# Altium project van_logic_board.PrjPcb
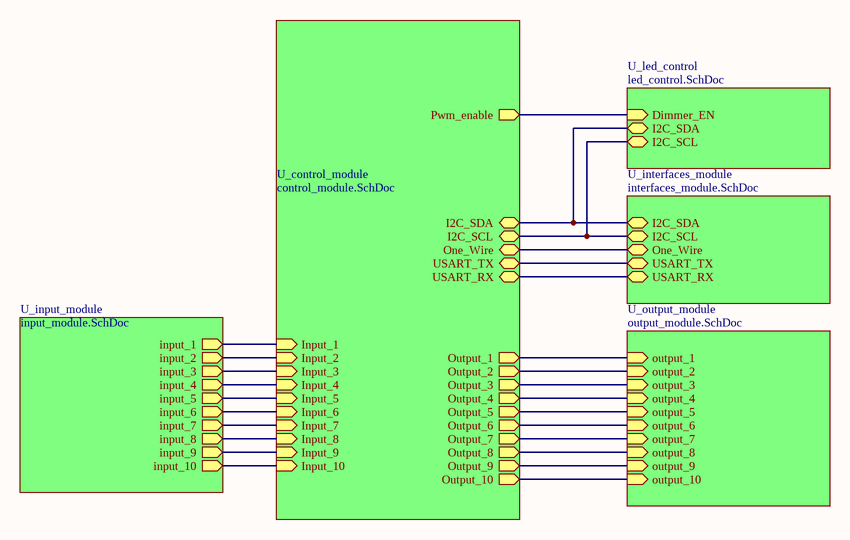
[diagram p0: main.SchDoc]
4 sheets, 61 parts. Net scope: hierarchical (ports join the sheet entries above them; power ports are global).
Board file: logic_board.PcbDoc
Sheets:
  main.SchDoc
  inputs.SchDoc
  mcu_power_supply.SchDoc
  pwm_outputs.SchDoc

## Sheet main.SchDoc
size A4

### Sub-sheets
U_control_module = control_module.SchDoc (file not in this document): I2C_SDA (bidir), USART_RX (bidir), USART_TX (bidir), I2C_SCL (bidir), One_Wire (bidir), Input_4 (in), Input_5 (in), Input_1 (in), Input_2 (in), Input_6 (in), Input_3 (in), Output_6 (out), Output_2 (out), Output_4 (out), Output_5 (out), Output_1 (out), Output_3 (out), Input_8 (in), Input_9 (in), Input_7 (in), Input_10 (in), Output_9 (out), Output_10 (out), Output_8 (out), Output_7 (out), Pwm_enable (out)
U_input_module = input_module.SchDoc (file not in this document): input_1 (out), input_2 (out), input_3 (out), input_4 (out), input_5 (out), input_6 (out), input_9 (out), input_10 (out), input_7 (out), input_8 (out)
U_interfaces_module = interfaces_module.SchDoc (file not in this document): I2C_SDA (bidir), I2C_SCL (bidir), One_Wire (bidir), USART_TX (bidir), USART_RX (bidir)
U_led_control = led_control.SchDoc (file not in this document): I2C_SDA (bidir), I2C_SCL (bidir), Dimmer_EN (in)
U_output_module = output_module.SchDoc (file not in this document): output_3 (in), output_4 (in), output_2 (in), output_5 (in), output_1 (in), output_6 (in), output_7 (in), output_8 (in), output_9 (in), output_10 (in)

### Nets
(unnamed): sheet U_control_module/I2C_SDA, sheet U_interfaces_module/I2C_SDA, sheet U_led_control/I2C_SDA
(unnamed): sheet U_control_module/USART_RX, sheet U_interfaces_module/USART_RX
(unnamed): sheet U_control_module/USART_TX, sheet U_interfaces_module/USART_TX
(unnamed): sheet U_control_module/I2C_SCL, sheet U_interfaces_module/I2C_SCL, sheet U_led_control/I2C_SCL
(unnamed): sheet U_control_module/One_Wire, sheet U_interfaces_module/One_Wire
(unnamed): sheet U_control_module/Input_4, sheet U_input_module/input_4
(unnamed): sheet U_control_module/Input_5, sheet U_input_module/input_5
(unnamed): sheet U_control_module/Input_1, sheet U_input_module/input_1
(unnamed): sheet U_control_module/Input_2, sheet U_input_module/input_2
(unnamed): sheet U_control_module/Input_6, sheet U_input_module/input_6
(unnamed): sheet U_control_module/Input_3, sheet U_input_module/input_3
(unnamed): sheet U_control_module/Output_6, sheet U_output_module/output_6
(unnamed): sheet U_control_module/Output_2, sheet U_output_module/output_2
(unnamed): sheet U_control_module/Output_4, sheet U_output_module/output_4
(unnamed): sheet U_control_module/Output_5, sheet U_output_module/output_5
(unnamed): sheet U_control_module/Output_1, sheet U_output_module/output_1
(unnamed): sheet U_control_module/Output_3, sheet U_output_module/output_3
(unnamed): sheet U_control_module/Input_8, sheet U_input_module/input_8
(unnamed): sheet U_control_module/Input_9, sheet U_input_module/input_9
(unnamed): sheet U_control_module/Input_7, sheet U_input_module/input_7
(unnamed): sheet U_control_module/Input_10, sheet U_input_module/input_10
(unnamed): sheet U_control_module/Output_9, sheet U_output_module/output_9
(unnamed): sheet U_control_module/Output_10, sheet U_output_module/output_10
(unnamed): sheet U_control_module/Output_8, sheet U_output_module/output_8
(unnamed): sheet U_control_module/Output_7, sheet U_output_module/output_7
(unnamed): sheet U_control_module/Pwm_enable, sheet U_led_control/Dimmer_EN

## Sheet inputs.SchDoc
size A3
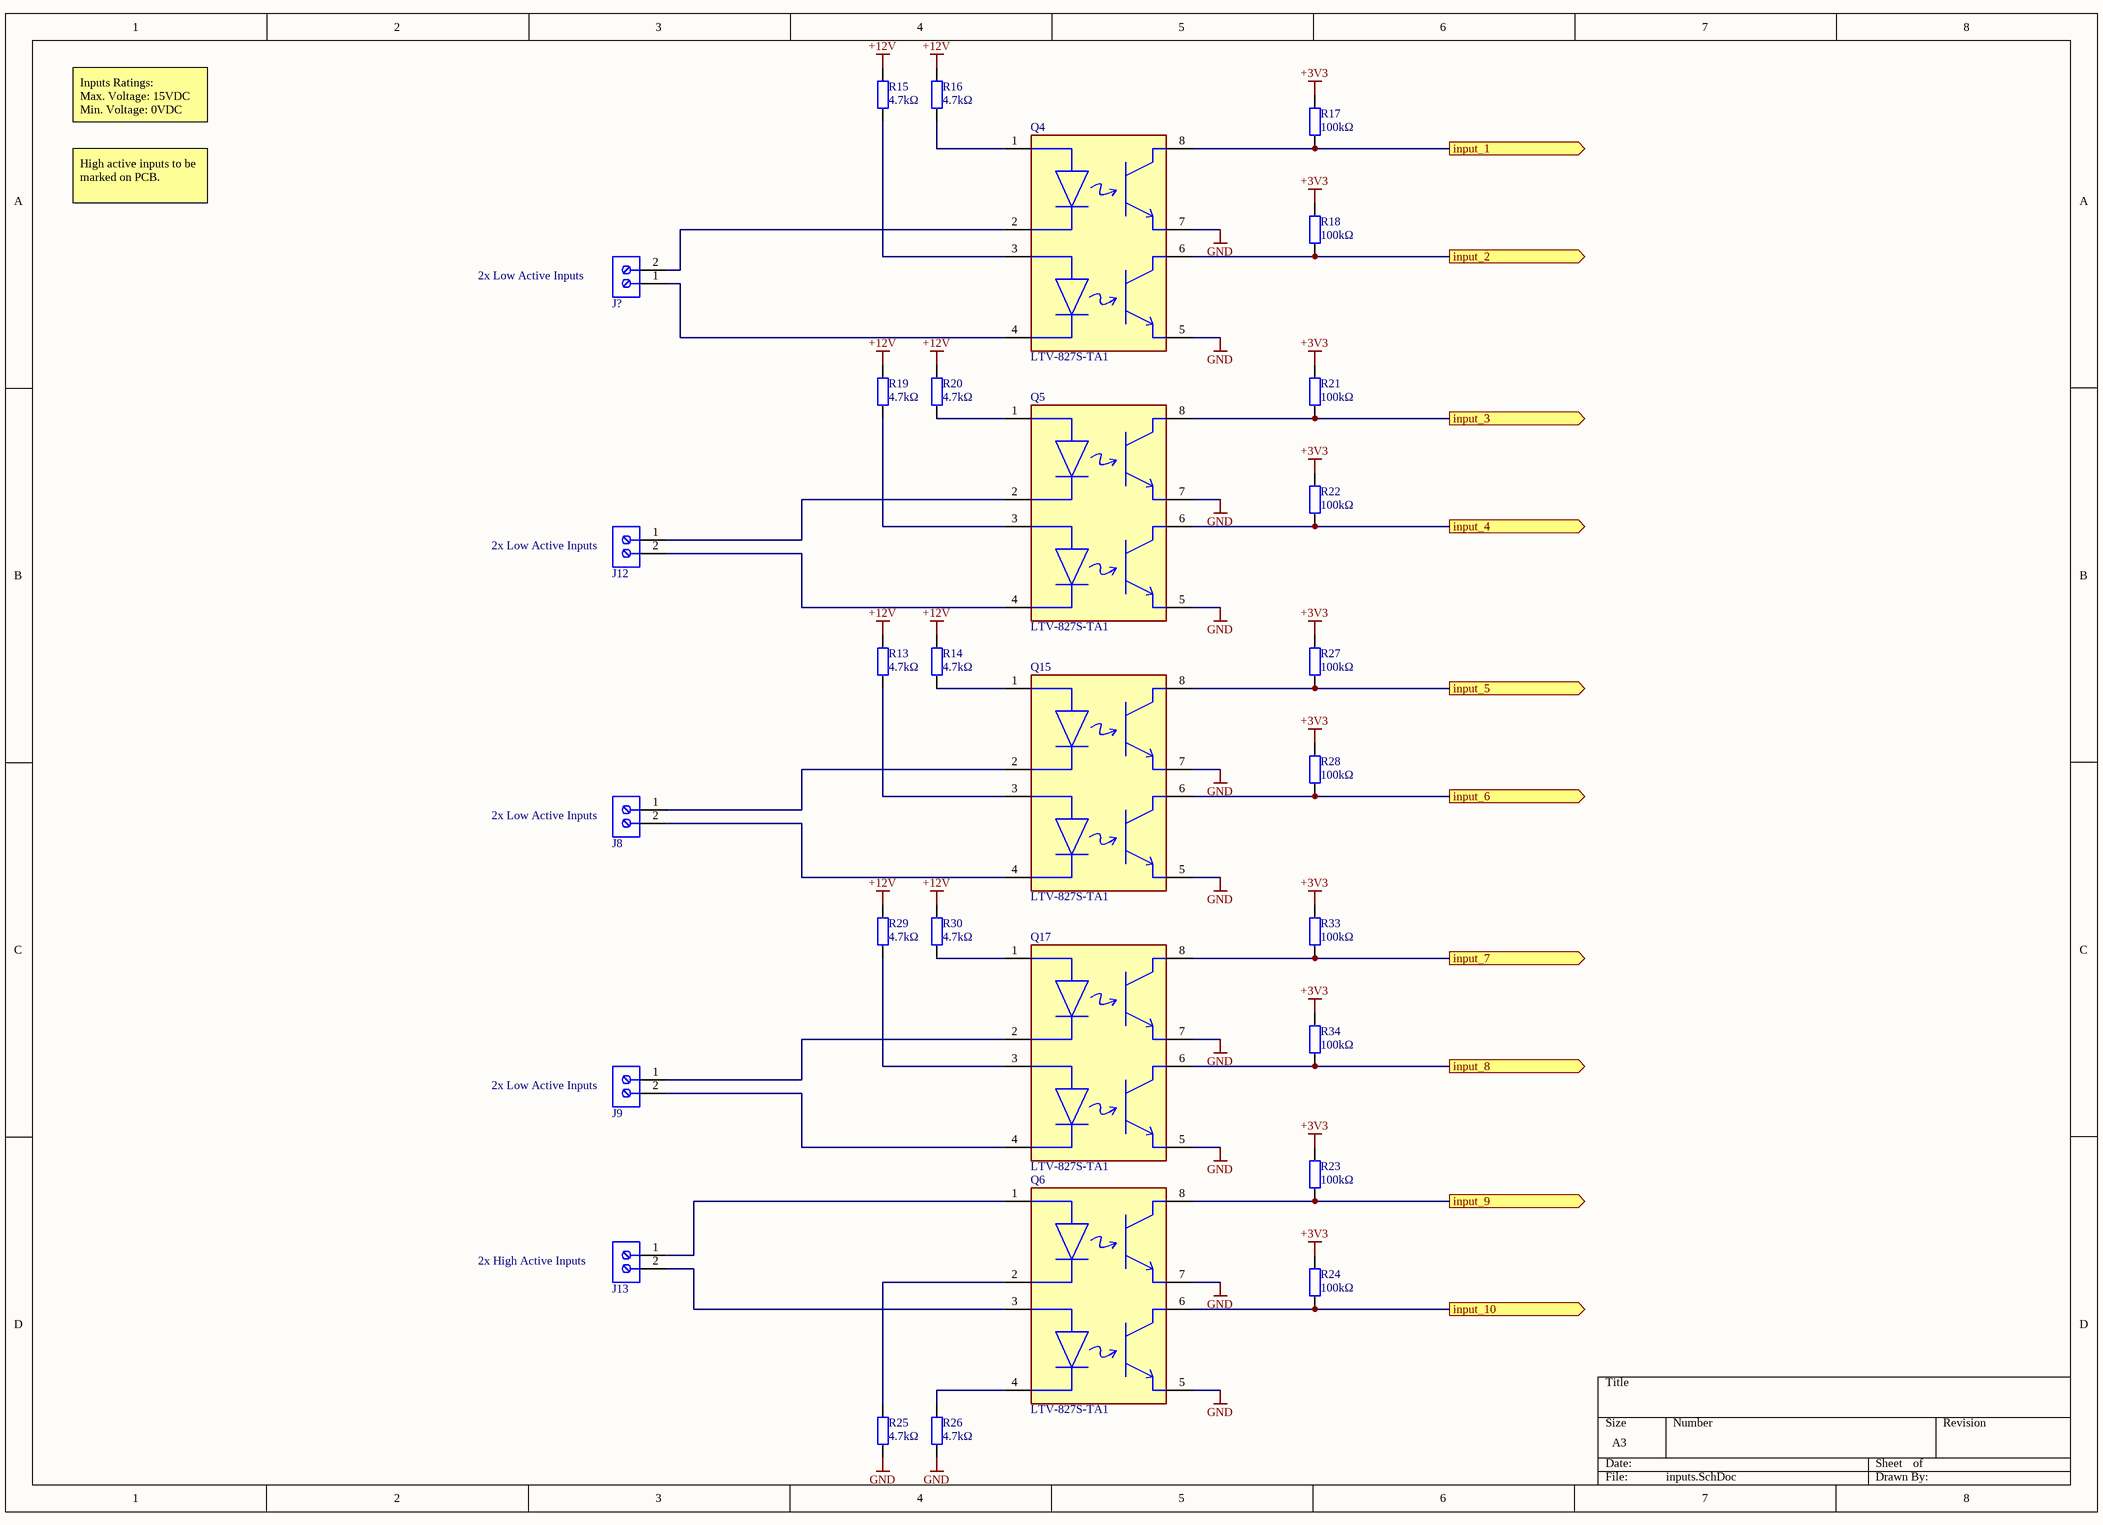
[diagram p1: inputs.SchDoc]

### Parts
J8  282836-2  [TECO-282836-2_V]  (value not drawn)
J9  282836-2  [TECO-282836-2_V]  (value not drawn)
J12  282836-2  [TECO-282836-2_V]  (value not drawn)
J13  282836-2  [TECO-282836-2_V]  (value not drawn)
J?  282836-2  [TECO-282836-2_V]  (value not drawn)
Q4  LTV-827S-TA1  [FP-LTV-827S-TA1-MFG]
Q5  LTV-827S-TA1  [FP-LTV-827S-TA1-MFG]
Q6  LTV-827S-TA1  [FP-LTV-827S-TA1-MFG]
Q15  LTV-827S-TA1  [FP-LTV-827S-TA1-MFG]
Q17  LTV-827S-TA1  [FP-LTV-827S-TA1-MFG]
R13  4.7kΩ  [RESC2013X50X30ML20T20]
R14  4.7kΩ  [RESC2013X50X30ML20T20]
R15  4.7kΩ  [RESC2013X50X30ML20T20]
R16  4.7kΩ  [RESC2013X50X30ML20T20]
R17  100kΩ  [RESC2013X50X30ML20T20]
R18  100kΩ  [RESC2013X50X30ML20T20]
R19  4.7kΩ  [RESC2013X50X30ML20T20]
R20  4.7kΩ  [RESC2013X50X30ML20T20]
R21  100kΩ  [RESC2013X50X30ML20T20]
R22  100kΩ  [RESC2013X50X30ML20T20]
R23  100kΩ  [RESC2013X50X30ML20T20]
R24  100kΩ  [RESC2013X50X30ML20T20]
R25  4.7kΩ  [RESC2013X50X30ML20T20]
R26  4.7kΩ  [RESC2013X50X30ML20T20]
R27  100kΩ  [RESC2013X50X30ML20T20]
R28  100kΩ  [RESC2013X50X30ML20T20]
R29  4.7kΩ  [RESC2013X50X30ML20T20]
R30  4.7kΩ  [RESC2013X50X30ML20T20]
R33  100kΩ  [RESC2013X50X30ML20T20]
R34  100kΩ  [RESC2013X50X30ML20T20]

### Ports
input_1 (out), input_2 (out), input_3 (out), input_4 (out), input_5 (out), input_6 (out), input_7 (out), input_8 (out), input_9 (out), input_10 (out)

### Nets
+3V3: R17.1 R18.1 R21.1 R22.1 R23.1 R24.1 R27.1 R28.1 R33.1 R34.1
+12V: R13.1 R14.1 R15.1 R16.1 R19.1 R20.1 R29.1 R30.1
GND: Q4.5(E) Q4.7(E) Q5.5(E) Q5.7(E) Q6.5(E) Q6.7(E) Q15.5(E) Q15.7(E) Q17.5(E) Q17.7(E) R25.2 R26.2
NetJ8_1: J8.1 Q15.2(1_Cathode)
NetJ8_2: J8.2 Q15.4(2_Cathode)
NetJ9_1: J9.1 Q17.2(1_Cathode)
NetJ9_2: J9.2 Q17.4(2_Cathode)
NetJ12_1: J12.1 Q5.2(1_Cathode)
NetJ12_2: J12.2 Q5.4(2_Cathode)
NetJ13_1: J13.1 Q6.1(1_Anode)
NetJ13_2: J13.2 Q6.3(2_Anode)
NetJ?_1: J?.1 Q4.4(2_Cathode)
NetJ?_2: J?.2 Q4.2(1_Cathode)
NetQ4_1: Q4.1(1_Anode) R16.2
NetQ4_3: Q4.3(2_Anode) R15.2
NetQ4_6: Q4.6(C) R18.2 ; port input_2
NetQ4_8: Q4.8(C) R17.2 ; port input_1
NetQ5_1: Q5.1(1_Anode) R20.2
NetQ5_3: Q5.3(2_Anode) R19.2
NetQ5_6: Q5.6(C) R22.2 ; port input_4
NetQ5_8: Q5.8(C) R21.2 ; port input_3
NetQ6_2: Q6.2(1_Cathode) R25.1
NetQ6_4: Q6.4(2_Cathode) R26.1
NetQ6_6: Q6.6(C) R24.2 ; port input_10
NetQ6_8: Q6.8(C) R23.2 ; port input_9
NetQ15_1: Q15.1(1_Anode) R14.2
NetQ15_3: Q15.3(2_Anode) R13.2
NetQ15_6: Q15.6(C) R28.2 ; port input_6
NetQ15_8: Q15.8(C) R27.2 ; port input_5
NetQ17_1: Q17.1(1_Anode) R30.2
NetQ17_3: Q17.3(2_Anode) R29.2
NetQ17_6: Q17.6(C) R34.2 ; port input_8
NetQ17_8: Q17.8(C) R33.2 ; port input_7

### Notes on the sheet
- Inputs Ratings:
  Max. Voltage: 15VDC
  Min. Voltage: 0VDC
- High active inputs to be marked on PCB.
- (near J?) 2x Low Active Inputs
- (near J12) 2x Low Active Inputs
- (near J8) 2x Low Active Inputs
- (near J9) 2x Low Active Inputs
- (near J13) 2x High Active Inputs

### Library data of the parts
J8 J9 J12 J13 J? = CMP-1684-00017-1: Female Header, Pitch 5 mm, 1 x 2 Position, Height 10 mm, Tail Length 3.5 mm, Rohs, Bulk; Manufacturer: TE Connectivity; Wire Gauge: 16-30AWG; Product Training Modules: Wire-to-BoardEurostyleTerminalBlocks; Clamp Material - Plating: Brass-NickelPlated; Voltage: 300V; Mating Orientation: HorizontalwithBoard; Current: 13.5A; Pitch: 0.197"(5.00mm); Screw Thread: M3; 3D Model: 282836-2.pdf; Other Names: 5ULV-02B / A98076; Dynamic Catalog: BuchananSeries; Number of Levels: 1; Torque - Screw: 0.68Nm(6Lb-In); Featured Product: EurostyleTerminalBlockConnectors; Positions Per Level: 2; Wire Termination: Screw-RisingCageClamp; Datasheet URL: http://www.te.com.cn/commerce/DocumentDelivery/DDEController?Action=showdoc&DocId=Catalog+Section%7F1308389_EUROSTYLE_TERMINAL_BLOCKS%7F0607%7Fpdf%7FEnglish%7FENG_CS_1308389_EUROSTYLE_TERMINAL_BLOCKS_0607.pdf%7F282836-2; Color: Green; Family: TerminalBlocks-WiretoBoard; RoHS Information: 282836-2StatementofCompliance; Standard Package: 300; Contact Material - Plating: Brass-TinPlated; Manufacturer URL: http://www.te.com; Housing Material: Polyamide(PA66),Nylon6/6; Features: Interlocking(Side); Package Description: Female Header, Pitch 5 mm, 1 x 2 Position, Height 10 mm, Tail Length 3.5 mm; Mounting Type: ThroughHole; Package Reference: THD; Packaging: Bulk; Series: Buchanan; Category: Connectors,Interconnects; Screw Material - Plating: Brass-NickelPlated
Q4-Q6 Q15 Q17 = CMP-22018-000005-1: OPTOISOLATOR 5KV 2CH TRANS 8-SMD; Number of Channels: 2; Forward Current: 50mA; Reverse Breakdown Voltage: 6V; Current Transfer Ratio: 600%; Collector Emitter Saturation Voltage: 200mV; Collector Emitter Voltage (VCEO): 35V; Max Power Dissipation: 200mW; Rise Time: 18000ns; Forward Voltage: 1.4V; Number of Elements: 2; Min Operating Temperature: -30°C; Number of Circuits: 2; Max Collector Current: 50mA; Packaging: Tape and Reel; Max Input Current: 50mA; Case/Package: SMD/SMT; Radiation Hardening: No; Package Quantity: 1000; Max Output Voltage: 35V; Output Current per Channel: 50mA; Fall Time: 18000ns; Mount: Surface Mount; Isolation Voltage: 5kV; Power Dissipation: 200mW; Lead Free: Lead Free; Max Operating Temperature: 110°C; Output Voltage: 35V; Number of Pins: 8
R13-R30 R33 R34 = Res_0805: Resistor

## Sheet mcu_power_supply.SchDoc
size A4
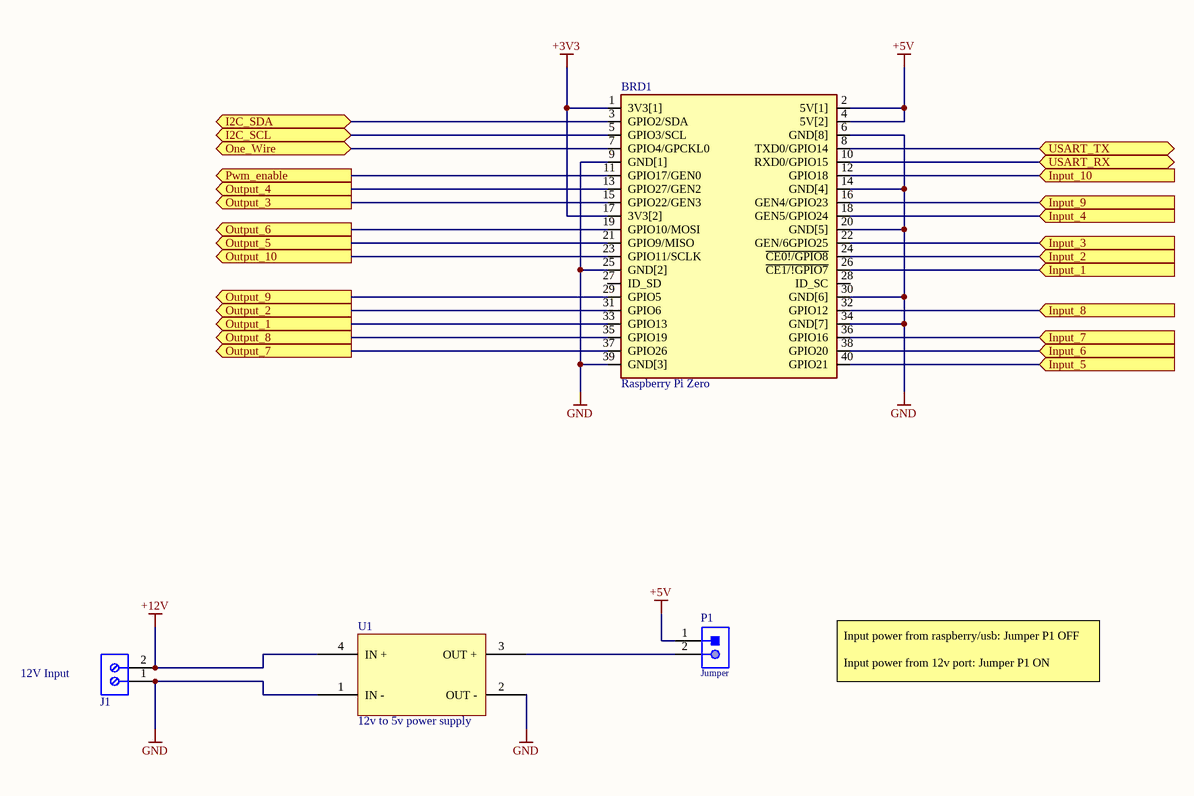
[diagram p2: mcu_power_supply.SchDoc]

### Parts
BRD1  Raspberry Pi Zero  [RASPBERRY_PI_ZERO]
J1  282836-2  [TECO-282836-2_V]  (value not drawn)
P1  Jumper  [61300211121]
U1  12v to 5v power supply  [5v_power_supply]

### Ports
I2C_SCL (bidir), I2C_SDA (bidir), Input_1 (in), Input_2 (in), Input_3 (in), Input_4 (in), Input_5 (in), Input_6 (in), Input_7 (in), Input_8 (in), Input_9 (in), Input_10 (in), One_Wire (bidir), Output_1 (out), Output_2 (out), Output_3 (out), Output_4 (out), Output_5 (out), Output_6 (out), Output_7 (out), Output_8 (out), Output_9 (out), Output_10 (out), Pwm_enable (out), USART_RX (bidir), USART_TX (bidir)

### Nets
+3V3: BRD1.1(3V3[1]) BRD1.17(3V3[2])
+5V: BRD1.2(5V[1]) BRD1.4(5V[2]) P1.1
+12V: J1.2 U1.4(IN_+)
GND: BRD1.6(GND[8]) BRD1.9(GND[1]) BRD1.14(GND[4]) BRD1.20(GND[5]) BRD1.25(GND[2]) BRD1.30(GND[6]) BRD1.34(GND[7]) BRD1.39(GND[3]) J1.1 U1.1(IN_-) U1.2(OUT_-)
NetBRD1_3: BRD1.3(GPIO2/SDA) ; port I2C_SDA
NetBRD1_5: BRD1.5(GPIO3/SCL) ; port I2C_SCL
NetBRD1_7: BRD1.7(GPIO4/GPCKL0) ; port One_Wire
NetBRD1_8: BRD1.8(TXD0/GPIO14) ; port USART_TX
NetBRD1_10: BRD1.10(RXD0/GPIO15) ; port USART_RX
NetBRD1_11: BRD1.11(GPIO17/GEN0) ; port Pwm_enable
NetBRD1_12: BRD1.12(GPIO18) ; port Input_10
NetBRD1_13: BRD1.13(GPIO27/GEN2) ; port Output_4
NetBRD1_15: BRD1.15(GPIO22/GEN3) ; port Output_3
NetBRD1_16: BRD1.16(GEN4/GPIO23) ; port Input_9
NetBRD1_18: BRD1.18(GEN5/GPIO24) ; port Input_4
NetBRD1_19: BRD1.19(GPIO10/MOSI) ; port Output_6
NetBRD1_21: BRD1.21(GPIO9/MISO) ; port Output_5
NetBRD1_22: BRD1.22(GEN/6GPIO25) ; port Input_3
NetBRD1_23: BRD1.23(GPIO11/SCLK) ; port Output_10
NetBRD1_24: BRD1.24(~{CE0!/GPIO8}) ; port Input_2
NetBRD1_26: BRD1.26(~{CE1/!GPIO7}) ; port Input_1
NetBRD1_29: BRD1.29(GPIO5) ; port Output_9
NetBRD1_31: BRD1.31(GPIO6) ; port Output_2
NetBRD1_32: BRD1.32(GPIO12) ; port Input_8
NetBRD1_33: BRD1.33(GPIO13) ; port Output_1
NetBRD1_35: BRD1.35(GPIO19) ; port Output_8
NetBRD1_36: BRD1.36(GPIO16) ; port Input_7
NetBRD1_37: BRD1.37(GPIO26) ; port Output_7
NetBRD1_38: BRD1.38(GPIO20) ; port Input_6
NetBRD1_40: BRD1.40(GPIO21) ; port Input_5
NetP1_2: P1.2 U1.3(OUT_+)

Not connected (* = marked no-connect by the designer): BRD1 27(ID_SD) 28(ID_SC)

### Notes on the sheet
- (near J1) 12V Input
- Input power from raspberry/usb: Jumper P1 OFF
  Input power from 12v port: Jumper P1 ON

### Library data of the parts
BRD1 = MCU_raspberryPi_zero: Raspberry Pi Zero with Header; MP: ADA3708; Availability: Unavailable; Package: None; MF: Raspberry Pi; Value: *; Price: None; SnapEDA_Link: https://www.snapeda.com/parts/ADA3708/Raspberry%20Pi/view-part/2770118/?ref=snap
J1 = CMP-1684-00017-1: as J8 on sheet inputs; Datasheet URL: http://www.te.com.cn/commerce/DocumentDelivery/DDEController?Action=showdoc&DocId=Catalog+Section%7F1308389_EUROSTYLE_TERMINAL_BLOCKS%7F0607%7Fpdf%7FEnglish%7FENG_CS_1308389_EUROSTYLE_TERMINAL_BLOCKS_0607.pdf%7F282836-2; Color: Green; Family: TerminalBlocks-WiretoBoard; RoHS Information: 282836-2StatementofCompliance; Standard Package: 300; Contact Material - Plating: Brass-TinPlated; Manufacturer URL: http://www.te.com; Housing Material: Polyamide(PA66),Nylon6/6; Features: Interlocking(Side); Package Description: Female Header, Pitch 5 mm, 1 x 2 Position, Height 10 mm, Tail Length 3.5 mm; Mounting Type: ThroughHole; Package Reference: THD; Packaging: Bulk; Series: Buchanan; Category: Connectors,Interconnects; Screw Material - Plating: Brass-NickelPlated
P1 = CMP-1712-00002-4: THT Vertical Pin Header WR-PHD, Pitch 2.54 mm, Single Row, 2 pins; Manufacturer: Wurth Elektronik; Rated Current: 3A; Gender: Male; Withstanding Voltage: 500VAC; Working Voltage: 250VAC; Pitch: 2.54mm; Contact Resistance: 20mOhm; Pin Number: 2; Mounting Technology: THT; Orientation: Vertical; Operating Temperature: -40to105degC; Packaging: Bag; Publisher: WurthElektronik; Datasheet URL: https://katalog.we-online.de/em/datasheet/6130xx11121.pdf; Manufacturer URL: http://www.we-online.de; Row Number: Single; Package Reference: 61300211121; Part Number: 61300211121
U1 = power_supply_5v: 12V TO 5V buck converter

## Sheet pwm_outputs.SchDoc
size A3
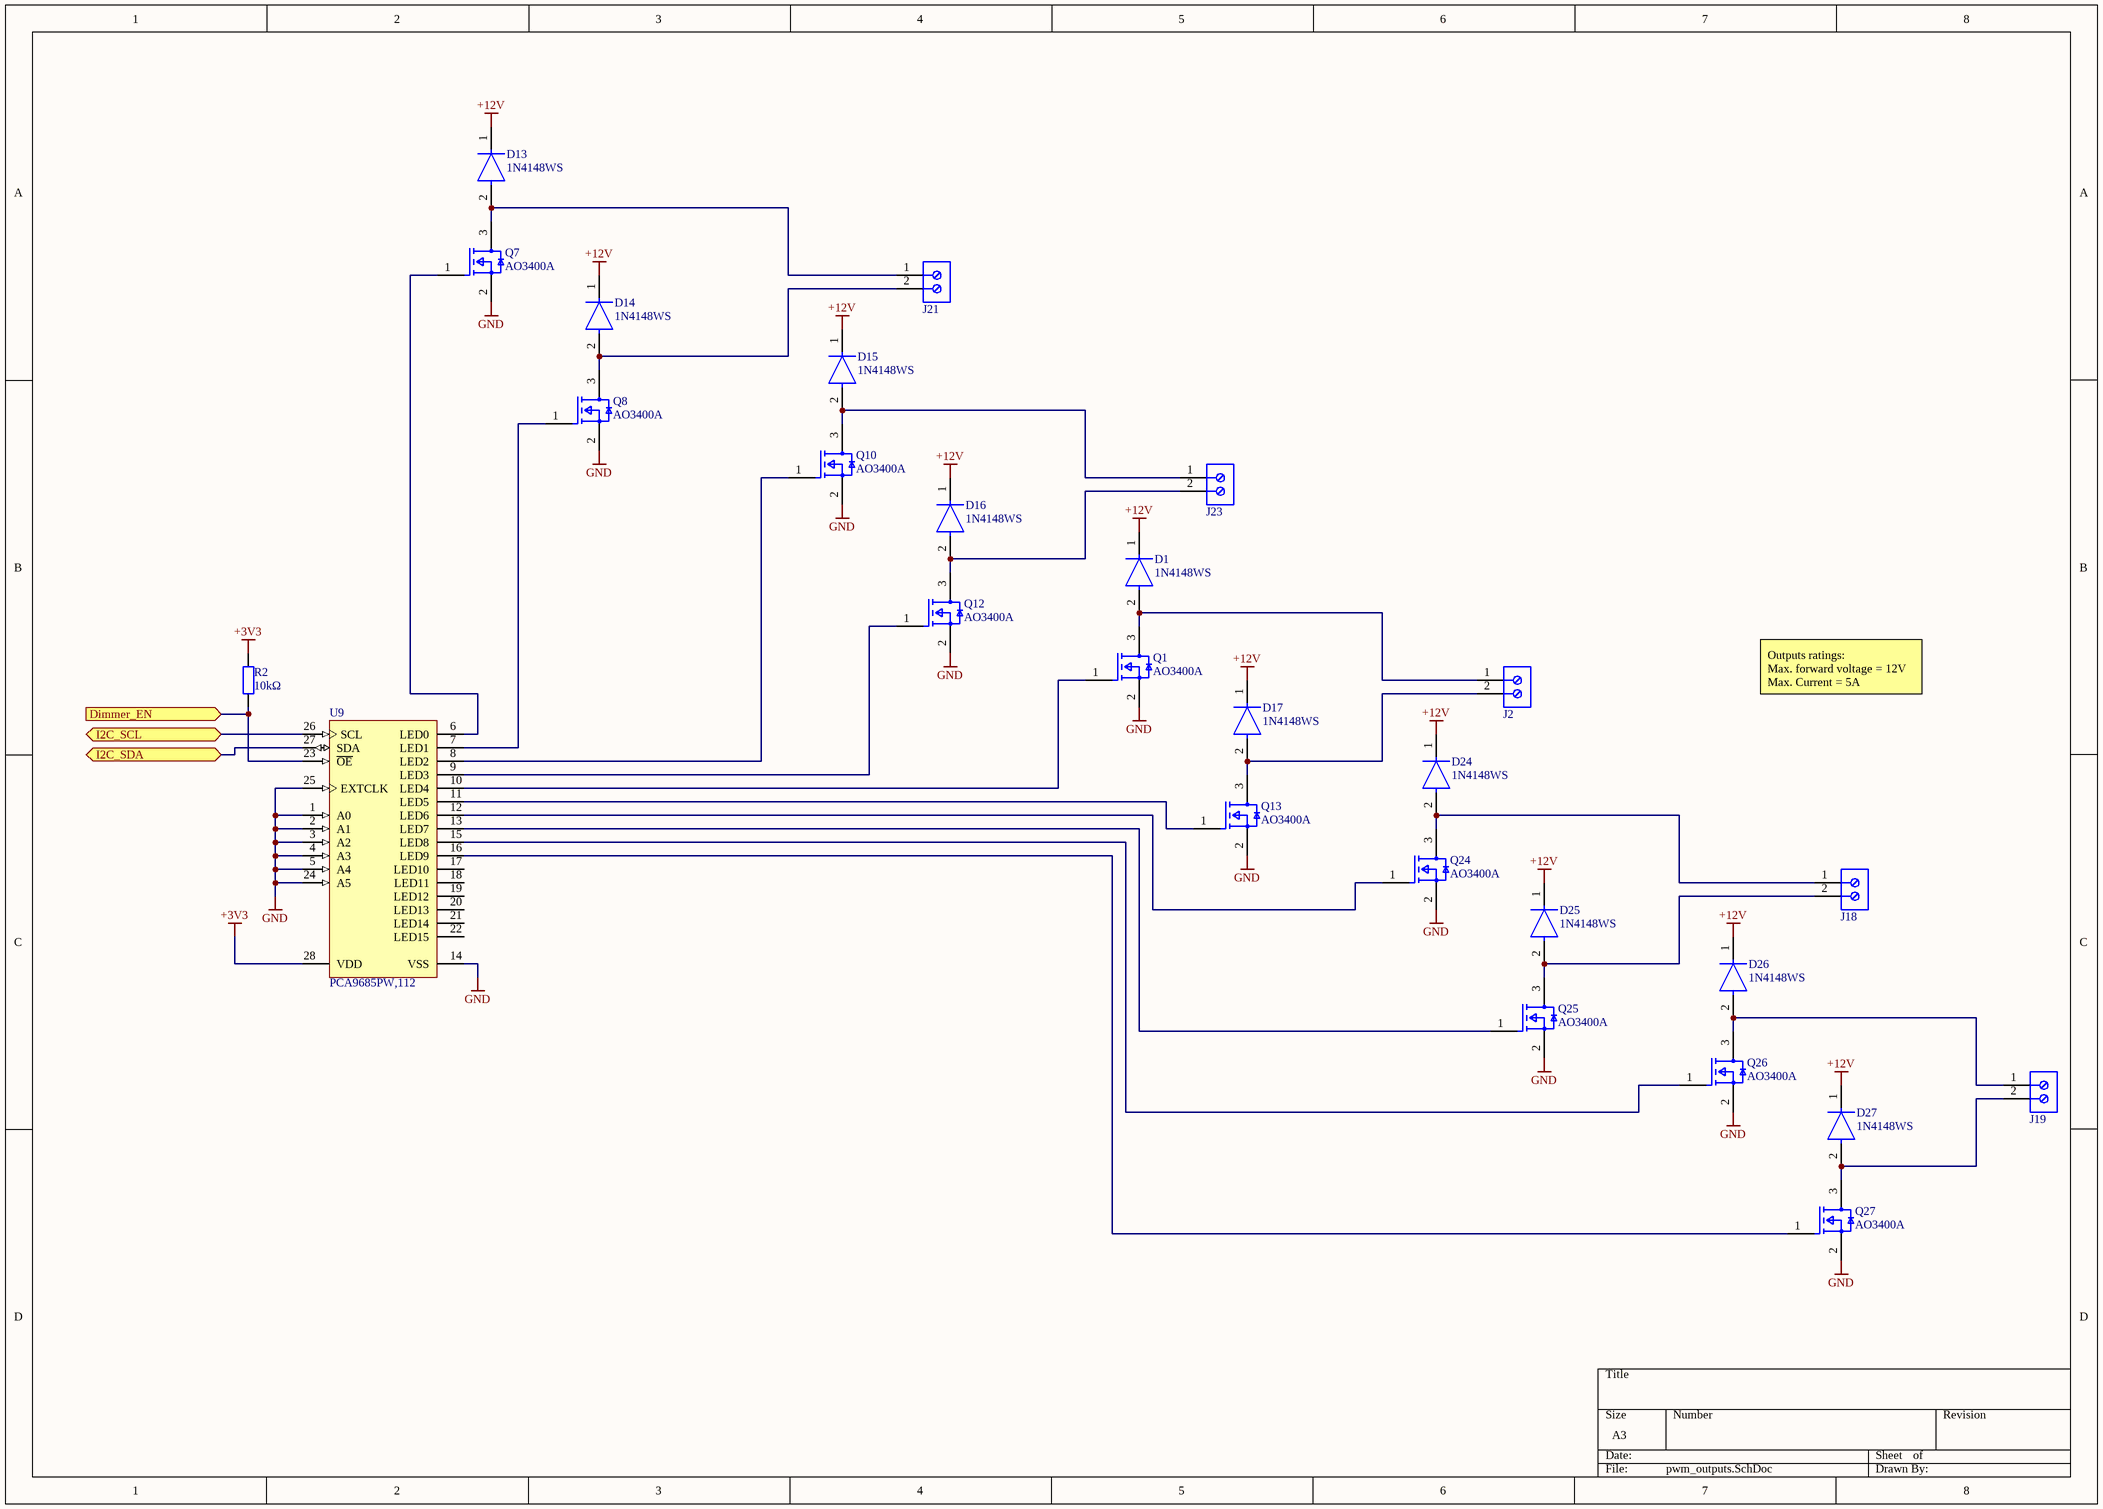
[diagram p3: pwm_outputs.SchDoc]

### Parts
D1  1N4148WS  [FP-477AB-IPC_C]
D13  1N4148WS  [FP-477AB-IPC_C]
D14  1N4148WS  [FP-477AB-IPC_C]
D15  1N4148WS  [FP-477AB-IPC_C]
D16  1N4148WS  [FP-477AB-IPC_C]
D17  1N4148WS  [FP-477AB-IPC_C]
D24  1N4148WS  [FP-477AB-IPC_C]
D25  1N4148WS  [FP-477AB-IPC_C]
D26  1N4148WS  [FP-477AB-IPC_C]
D27  1N4148WS  [FP-477AB-IPC_C]
J2  282836-2  [TECO-282836-2_V]  (value not drawn)
J18  282836-2  [TECO-282836-2_V]  (value not drawn)
J19  282836-2  [TECO-282836-2_V]  (value not drawn)
J21  282836-2  [TECO-282836-2_V]  (value not drawn)
J23  282836-2  [TECO-282836-2_V]  (value not drawn)
Q1  AO3400A  [SOT-23]
Q7  AO3400A  [SOT-23]
Q8  AO3400A  [SOT-23]
Q10  AO3400A  [SOT-23]
Q12  AO3400A  [SOT-23]
Q13  AO3400A  [SOT-23]
Q24  AO3400A  [SOT-23]
Q25  AO3400A  [SOT-23]
Q26  AO3400A  [SOT-23]
Q27  AO3400A  [SOT-23]
R2  10kΩ  [RESC2013X50X30ML20T20]
U9  PCA9685PW,112  [SOT361-1_V]

### Ports
Dimmer_EN (in), I2C_SCL (bidir), I2C_SDA (bidir)

### Nets
+3V3: R2.2 U9.28(VDD)
+12V: D1.1(C) D13.1(C) D14.1(C) D15.1(C) D16.1(C) D17.1(C) D24.1(C) D25.1(C) D26.1(C) D27.1(C)
GND: Q1.2(S) Q7.2(S) Q8.2(S) Q10.2(S) Q12.2(S) Q13.2(S) Q24.2(S) Q25.2(S) Q26.2(S) Q27.2(S) U9.1(A0) U9.2(A1) U9.3(A2) U9.4(A3) U9.5(A4) U9.14(VSS) U9.24(A5) U9.25(EXTCLK)
NetD1_2: D1.2(A) J2.1 Q1.3(D)
NetD13_2: D13.2(A) J21.1 Q7.3(D)
NetD14_2: D14.2(A) J21.2 Q8.3(D)
NetD15_2: D15.2(A) J23.1 Q10.3(D)
NetD16_2: D16.2(A) J23.2 Q12.3(D)
NetD17_2: D17.2(A) J2.2 Q13.3(D)
NetD24_2: D24.2(A) J18.1 Q24.3(D)
NetD25_2: D25.2(A) J18.2 Q25.3(D)
NetD26_2: D26.2(A) J19.1 Q26.3(D)
NetD27_2: D27.2(A) J19.2 Q27.3(D)
NetQ1_1: Q1.1(G) U9.10(LED4)
NetQ7_1: Q7.1(G) U9.6(LED0)
NetQ8_1: Q8.1(G) U9.7(LED1)
NetQ10_1: Q10.1(G) U9.8(LED2)
NetQ12_1: Q12.1(G) U9.9(LED3)
NetQ13_1: Q13.1(G) U9.11(LED5)
NetQ24_1: Q24.1(G) U9.12(LED6)
NetQ25_1: Q25.1(G) U9.13(LED7)
NetQ26_1: Q26.1(G) U9.15(LED8)
NetQ27_1: Q27.1(G) U9.16(LED9)
NetR2_1: R2.1 U9.23(~{OE}) ; port Dimmer_EN
NetU9_26: U9.26(SCL) ; port I2C_SCL
NetU9_27: U9.27(SDA) ; port I2C_SDA

Not connected (* = marked no-connect by the designer): U9 17(LED10) 18(LED11) 19(LED12) 20(LED13) 21(LED14) 22(LED15)

### Notes on the sheet
- Outputs ratings:
  Max. forward voltage = 12V
  Max. Current = 5A

### Library data of the parts
D1 D13-D17 D24-D27 = CMP-07163-000040-1: DIODE GEN PURP 75V 150MA SOD323F; Forward Voltage: 1V; Power Dissipation: 200mW; Element Configuration: Single; Max Forward Surge Current (Ifsm): 2A; Peak Reverse Current: 5uA; Recovery Time: 4ns; Package Quantity: 1; Number of Pins: 2; Height: 1mm; REACH SVHC: No SVHC; Max Reverse Voltage (DC): 75V; Forward Current: 150mA; Length: 1.8mm; Max Repetitive Reverse Voltage (Vrrm): 75V; Max Operating Temperature: 150°C; Average Rectified Current: 150mA; Contact Plating: Tin; Packaging: Tape and Reel; Radiation Hardening: No; Min Operating Temperature: -55°C; Width: 1.35mm; Weight: 0.0276g; Lead Free: Lead Free; Mount: Surface Mount; Reverse Voltage: 75V; Reverse Recovery Time: 4ns
J2 J18 J19 J21 J23 = CMP-1684-00017-1: as J8 on sheet inputs; Datasheet URL: http://www.te.com.cn/commerce/DocumentDelivery/DDEController?Action=showdoc&DocId=Catalog+Section%7F1308389_EUROSTYLE_TERMINAL_BLOCKS%7F0607%7Fpdf%7FEnglish%7FENG_CS_1308389_EUROSTYLE_TERMINAL_BLOCKS_0607.pdf%7F282836-2; Color: Green; Family: TerminalBlocks-WiretoBoard; RoHS Information: 282836-2StatementofCompliance; Standard Package: 300; Contact Material - Plating: Brass-TinPlated; Manufacturer URL: http://www.te.com; Housing Material: Polyamide(PA66),Nylon6/6; Features: Interlocking(Side); Package Description: Female Header, Pitch 5 mm, 1 x 2 Position, Height 10 mm, Tail Length 3.5 mm; Mounting Type: ThroughHole; Package Reference: THD; Packaging: Bulk; Series: Buchanan; Category: Connectors,Interconnects; Screw Material - Plating: Brass-NickelPlated
Q1 Q7 Q8 Q10 Q12 Q13 Q24-Q27 = MOSFET_AO3400A: MOSFET N-CH 30V 5.7A SOT23; Input Capacitance: 630pF; Number of Elements: 1; Rds On Max: 26.5mR; Max Power Dissipation: 1.4W; Gate to Source Voltage (Vgs): 12V; Min Operating Temperature: -55°C; Lead Free: Lead Free; Number of Pins: 3; Drain to Source Voltage (Vdss): 30V; Case/Package: SOT-23; Mount: Surface Mount; Continuous Drain Current (ID): 5.7A; Radiation Hardening: No; Packaging: Tape and Reel; Max Operating Temperature: 150°C; Power Dissipation: 1.4W
R2 = Res_0805: Resistor
U9 = CMP-1595-00004-2: 16-Channel, 12-Bit PWM Fm+ I2C-Bus LED Controller, 2.3 to 5.5 V, -40 to 85 degC, 28-Pin TSSOP (SOT361-1), RoHS, Tape and Reel; Supply Current Max: 10 mA; Supply Voltage Min: 2.3 V; Supply Voltage Max: 5.5 V; Frequency: 25000000 Hz; Temperature Min: -40 degC; PackageDescription: 28-Pin Small Outline Package, Body 9.7 x 4.4 mm, Pitch 0.65 mm; RoHS: TRUE; ComponentLink1Description: Manufacturer URL; Code_JEDEC: MO-153; PartNumber: PCA9685; ComponentLink2URL: http://www.nxp.com/documents/data_sheet/PCA9685.pdf; Packing: Tape and Reel; ComponentLink1URL: http://www.nxp.com/; ComponentLink3Description: Package Specification; ComponentLink2Description: Datasheet; ComponentLink3URL: http://www.nxp.com/documents/outline_drawing/sot361-1_po.pdf; DatasheetVersion: Rev. 4; Temperature Max: 85 degC; PackageVersion: 02/2003; Mounting Technology: Surface Mount

## Nets that join several sheets
+3V3: inputs (10 pins), mcu_power_supply (BRD1.1 BRD1.17), pwm_outputs (R2.2 U9.28)
+12V: inputs (8 pins), mcu_power_supply (J1.2 U1.4), pwm_outputs (10 pins)
GND: inputs (12 pins), mcu_power_supply (11 pins), pwm_outputs (18 pins)